# Altium schematic sheet Sheet1.SchDoc
size A; SheetNumber: 1; SheetTotal: 1
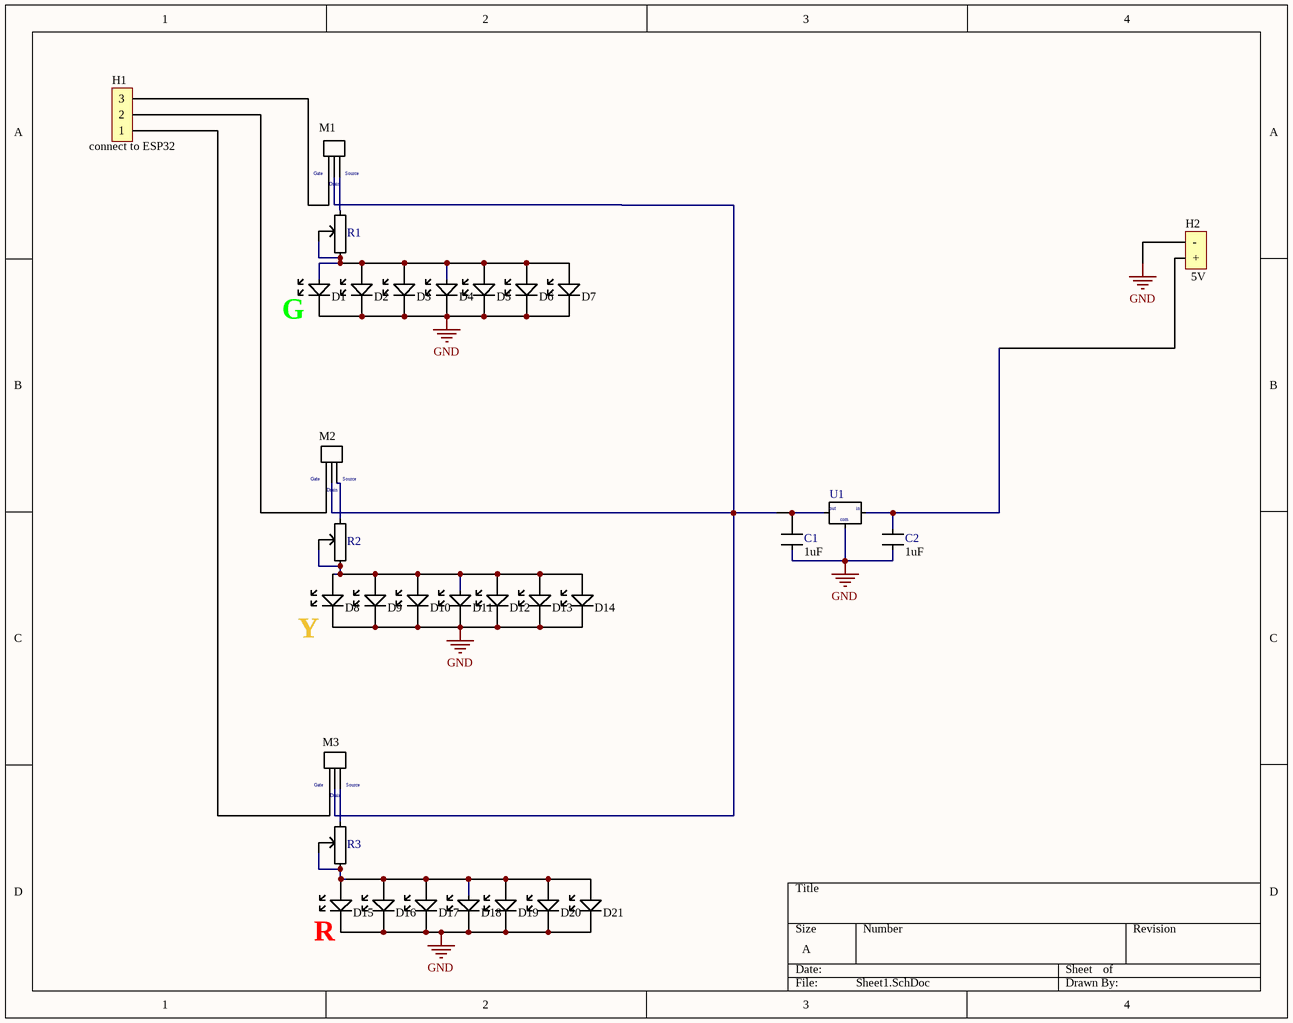
[diagram p0: Sheet1.SchDoc]

## Parts
C1  Parameter 1: 1uF  [Capacitor]  (hidden comment: Capacitor)
C2  Parameter 1: 1uF  [Capacitor]  (hidden comment: Capacitor)
D1  LED  [LED]  (value not drawn)
D2  LED  [LED]  (value not drawn)
D3  LED  [LED]  (value not drawn)
D4  LED  [LED]  (value not drawn)
D5  LED  [LED]  (value not drawn)
D6  LED  [LED]  (value not drawn)
D7  LED  [LED]  (value not drawn)
D8  LED  [LED]  (value not drawn)
D9  LED  [LED]  (value not drawn)
D10  LED  [LED]  (value not drawn)
D11  LED  [LED]  (value not drawn)
D12  LED  [LED]  (value not drawn)
D13  LED  [LED]  (value not drawn)
D14  LED  [LED]  (value not drawn)
D15  LED  [LED]  (value not drawn)
D16  LED  [LED]  (value not drawn)
D17  LED  [LED]  (value not drawn)
D18  LED  [LED]  (value not drawn)
D19  LED  [LED]  (value not drawn)
D20  LED  [LED]  (value not drawn)
D21  LED  [LED]  (value not drawn)
H1  PinHeader3  [Header x3]  (value not drawn)
H2  PinHeader2  [Header x2]  (value not drawn)
M1  Mosfet  [Mosfet]  (value not drawn)
M2  Mosfet  [Mosfet]  (value not drawn)
M3  Mosfet  [Mosfet]  (value not drawn)
R1  Potetiometer  [Potentiometer]  (value not drawn)
R2  Potetiometer  [Potentiometer]  (value not drawn)
R3  Potetiometer  [Potentiometer]  (value not drawn)
U1  Regulator  [SOT-223]  (value not drawn)

## Nets
GND: C1.1 C2.1 D1.1 D2.1 D3.1 D4.1 D5.1 D6.1 D7.1 D8.1 D9.1 D10.1 D11.1 D12.1 D13.1 D14.1 D15.1 D16.1 D17.1 D18.1 D19.1 D20.1 D21.1 H2.1(-) U1.3
NetC1_2: C1.2 M1.2 M2.2 M3.2 U1.1
NetC2_2: C2.2 H2.2(+) U1.2
NetD1_2: D1.2 D2.2 D3.2 D4.2 D5.2 D6.2 D7.2 R1.1 R1.3
NetD8_2: D8.2 D9.2 D10.2 D11.2 D12.2 D13.2 D14.2 R2.1 R2.3
NetD15_2: D15.2 D16.2 D17.2 D18.2 D19.2 D20.2 D21.2 R3.1 R3.3
NetH1_1: H1.1 M3.1
NetH1_2: H1.2 M2.1
NetH1_3: H1.3 M1.1
NetM1_3: M1.3 R1.2
NetM2_3: M2.3 R2.2
NetM3_3: M3.3 R3.2

## Notes on the sheet
- (near H1) connect to ESP32
- (near H2) 5V
- (near D1) G
- (near D8) Y
- (near D15) R
- (in symbol Mosfet) Gate; Source; Drain
- (in symbol Regulator) out; in; com